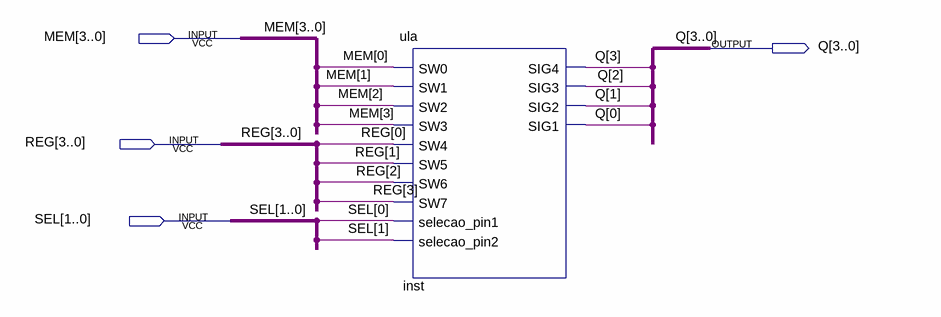
[diagram p0: schematic sheet]
// Quartus schematic ula_bus.bdf as structural Verilog: 1 symbols, 4 pins
module ula_bus (
  input  [3:0] MEM,
  input  [3:0] REG,
  input  [1:0] SEL,
  output [3:0] Q
);

  ula inst (
    .SW0(MEM[0]), .SW1(MEM[1]), .SW2(MEM[2]), .SW3(MEM[3]), .SW4(REG[0]), .SW5(REG[1]), .SW6(REG[2]),
    .SW7(REG[3]), .selecao_pin1(SEL[0]), .selecao_pin2(SEL[1]), .SIG4(Q[3]), .SIG3(Q[2]), .SIG2(Q[1]),
    .SIG1(Q[0]));
endmodule
